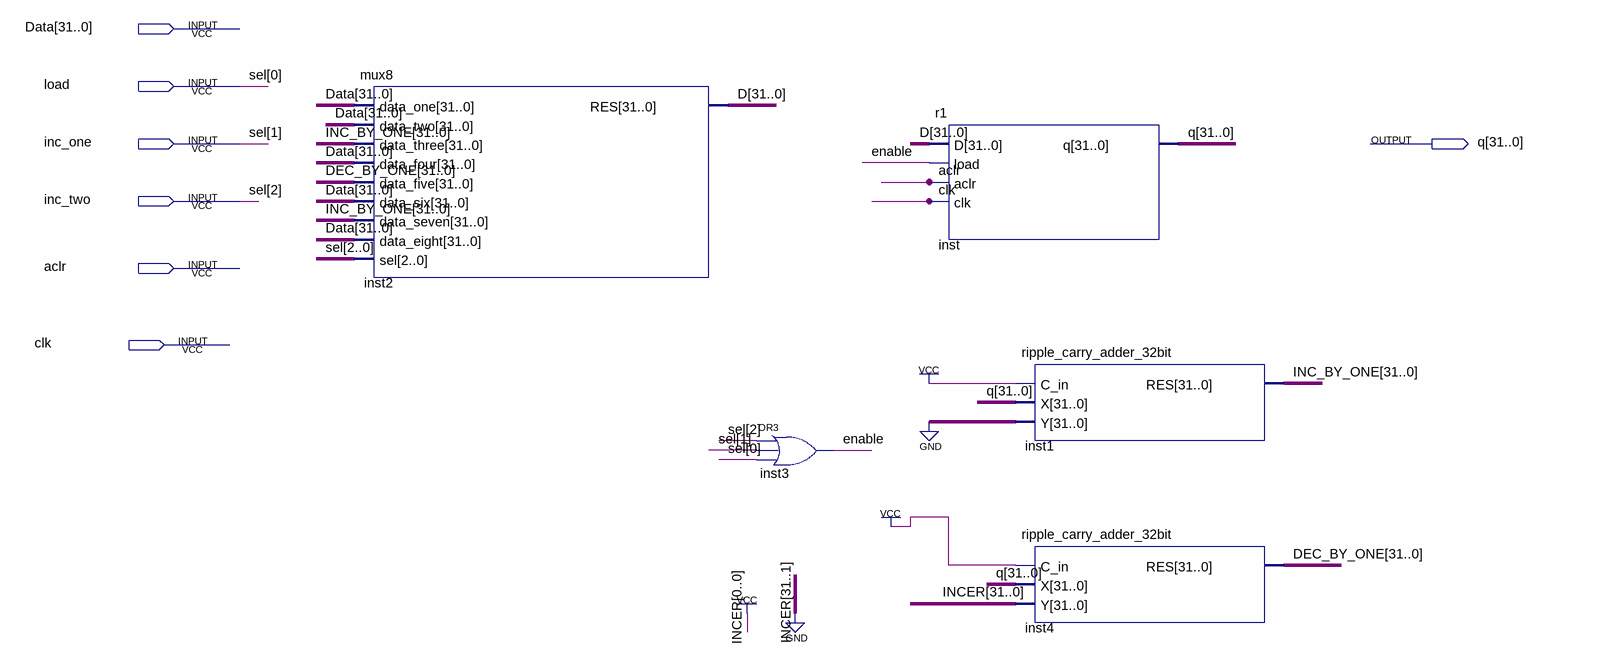
[diagram p0: schematic sheet]
// Quartus schematic r8.bdf as structural Verilog: 5 symbols, 7 pins
module r8 (
  input  [31:0] Data,
  input  load,
  input  inc_one,
  input  inc_two,
  input  aclr,
  input  clk,
  output [31:0] q
);

  wire enable;
  wire [31:0] D, DEC_BY_ONE, INC_BY_ONE;

  mux8 inst2 (
    .data_one(Data), .data_two(Data), .data_three(INC_BY_ONE), .data_four(Data), .data_five(DEC_BY_ONE),
    .data_six(Data), .data_seven(INC_BY_ONE), .data_eight(Data), .sel({inc_two, inc_one, load}), .RES(D));
  or inst3 (enable, inc_two, inc_one, load);
  r1 inst (.D(D), .load(enable), .aclr(aclr), .clk(clk), .q(q));
  ripple_carry_adder_32bit inst1 (.C_in(1'b1), .X(q), .Y({32{1'b0}}), .RES(INC_BY_ONE));
  ripple_carry_adder_32bit inst4 (.C_in(1'b1), .X(q), .Y(32'b00000000000000000000000000000001), .RES(DEC_BY_ONE));

  // Other names for the same wires on the sheet: sel[2:0] = {inc_two, inc_one, load}
endmodule
